# Altium project AMC_FMC_Carrier.PrjPcb (part 9 of 9)
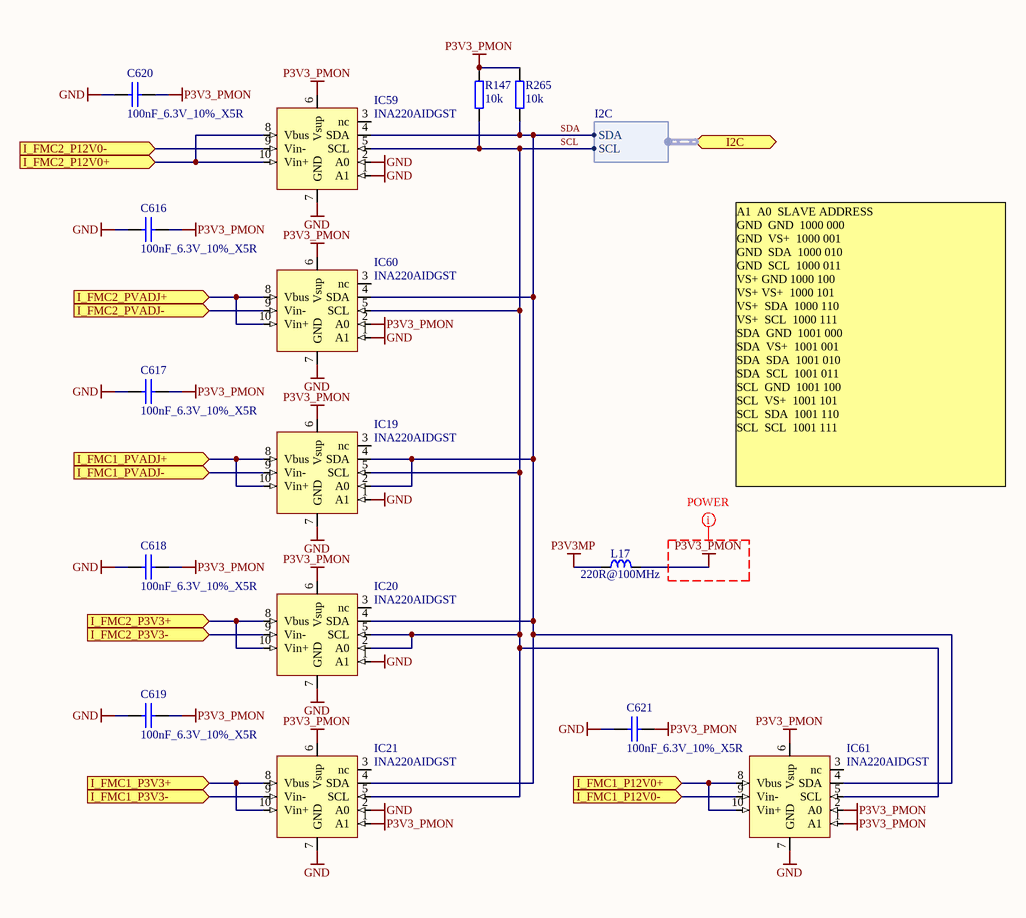
[diagram p28: UI_mon.SchDoc]

## Nets that join several sheets
FMC1_P3V3: HPC1 (10 pins), SUP_3.3_FMC (6 pins)
FMC2_P3V3: HPC2 (10 pins), SUP_3.3_FMC (6 pins)
GND: AMC_FMC_Carrier (43 pins), HPC1 (182 pins), HPC2 (181 pins), FPGA (17 pins), FPGA_SDRAM (C134.2 C138.2 C140.2 C141.2), FMC_HPC1 (16 pins), FMC_HPC2 (7 pins), FPGA_SUP (500 pins), SDRAM (150 pins), IPMI (5 pins), CPU (55 pins), USB_UART (9 pins), JTAG_Configuration (21 pins), M-LVDS PHY (65 pins), Clock_management (44 pins), Clock_WR (46 pins), FMC_Clocks (22 pins), AMC-SATA (6 pins), HeightRuleRoom1.9mm (Cxxx.1 Cxxx.2), SUP_1.2_1.8 (25 pins), SUP_3.3_FMC (34 pins), SUP_1V (37 pins), SUP_2.5_FMC (38 pins), UI_mon (18 pins)
MGTAVTT_G10: FPGA_MGT (R239.1), FPGA_SUP (21 pins)
MGTAVTT_G11: FPGA_MGT (R142.1), FPGA_SUP (21 pins)
P1V0: FPGA_SUP (123 pins), SUP_1V (23 pins)
P1V2: FPGA_SUP (FB7.1 FB8.1), SUP_1.2_1.8 (9 pins)
P1V5: FPGA_SUP (30 pins), SDRAM (108 pins), M-LVDS PHY (20 pins)
P1V8: FPGA_SUP (L12.1), SUP_1.2_1.8 (9 pins)
P3V3: FPGA (24 pins), FMC_HPC1 (LD1.4), FPGA_SUP (5 pins), JTAG_Configuration (10 pins), M-LVDS PHY (48 pins), Clock_management (7 pins), Clock_WR (L13.1 R220.2 R223.2 R272.2), FMC_Clocks (FB_FIN1.1 FB_FIN2.1)
P3V3MP: FMC_HPC1 (C102.1 IC56.7 R179.2), CPU (62 pins), SUP_1.2_1.8 (R77.1), SUP_1V (R110.2), SUP_2.5_FMC (C475.2 C476.1 IC11.6 IC11.11), UI_mon (L17.1)
P12V: SUP_1.2_1.8 (6 pins), SUP_3.3_FMC (11 pins), SUP_1V (15 pins), SUP_2.5_FMC (11 pins)
PVADJ1: HPC1 (8 pins), FMC_HPC1 (C100.1 IC56.2 R83.2 R178.2), FPGA_SUP (70 pins), SUP_2.5_FMC (5 pins)
PVADJ2: HPC2 (8 pins), FMC_HPC2 (R270.1), FPGA_SUP (69 pins), Clock_management (7 pins), SUP_2.5_FMC (5 pins)
VREF: FPGA_SDRAM (8 pins), SDRAM (16 pins)
VTT: FPGA_SDRAM (R143.1 R181.1), SDRAM (40 pins)
3P3VAUX_R: AMC_FMC_Carrier (R124.2), HPC2 (J1B.c34)
CLK20_VCXO: Clock_management (C410.1), Clock_WR (R217.2 R221.1)
CLKS1.CLK0_M2C_N: HPC1 (J1A.h5), FMC_HPC1 (IC2.H6), Clock_management (C485.1)
CLKS1.CLK0_M2C_P: HPC1 (J1A.h4), FMC_HPC1 (IC2.H7), Clock_management (C483.1)
CLKS1.CLK1_M2C_N: HPC1 (J1A.g3), FMC_HPC1 (IC2.N4), Clock_management (C489.1)
CLKS1.CLK1_M2C_P: HPC1 (J1A.g2), FMC_HPC1 (IC2.P5), Clock_management (C487.1)
CLKS1.CLK2_BIDIR_N: HPC1 (J1A.k5), FMC_HPC1 (IC2.G4), Clock_management (C493.1), FMC_Clocks (IC46.5)
CLKS1.CLK2_BIDIR_P: HPC1 (J1A.k4), FMC_HPC1 (IC2.G5), Clock_management (C491.1), FMC_Clocks (IC46.6)
CLKS1.CLK3_BIDIR_N: HPC1 (J1A.j3), FMC_HPC1 (IC2.R6), Clock_management (C497.1), FMC_Clocks (IC48.5)
CLKS1.CLK3_BIDIR_P: HPC1 (J1A.j2), FMC_HPC1 (IC2.R5), Clock_management (C495.1), FMC_Clocks (IC48.6)
CLKS1.CLK_DIR: HPC1 (J1A.b1), FMC_Clocks (IC46.3 IC48.3 R209.2)
CLKS2.CLK0_M2C_N: HPC2 (J1B.h5), FMC_HPC2 (IC2.AB30), Clock_management (C501.1)
CLKS2.CLK0_M2C_P: HPC2 (J1B.h4), FMC_HPC2 (IC2.AA30), Clock_management (C499.1)
CLKS2.CLK1_M2C_N: HPC2 (J1B.g3), FMC_HPC2 (IC2.AG29), Clock_management (C505.1)
CLKS2.CLK1_M2C_P: HPC2 (J1B.g2), FMC_HPC2 (IC2.AG30), Clock_management (C503.1)
CLKS2.CLK2_BIDIR_N: HPC2 (J1B.k5), FMC_HPC2 (IC2.AH29), Clock_management (C509.1), FMC_Clocks (IC47.5)
CLKS2.CLK2_BIDIR_P: HPC2 (J1B.k4), FMC_HPC2 (IC2.AH28), Clock_management (C507.1), FMC_Clocks (IC47.6)
CLKS2.CLK3_BIDIR_N: HPC2 (J1B.j3), FMC_HPC2 (IC2.Y30), Clock_management (C513.1), FMC_Clocks (IC49.5)
CLKS2.CLK3_BIDIR_P: HPC2 (J1B.j2), FMC_HPC2 (IC2.Y31), Clock_management (C511.1), FMC_Clocks (IC49.6)
CLKS2.CLK_DIR: HPC2 (J1B.b1), FMC_Clocks (IC47.3 IC49.3 R210.2)
CONSOLE_RXD: CPU (IC1.85 U1.27), USB_UART (R275.1)
CONSOLE_TXD: CPU (IC1.82 U1.28), USB_UART (R276.1)
CPU.SCL: FMC_HPC1 (IC56.6), CPU (IC1.47 R176.2 U1.26), Clock_management (R137.2)
CPU.SDA: FMC_HPC1 (IC56.5), CPU (IC1.46 R174.2 U1.25), Clock_management (R136.2)
DP1.DP0_C2M_N: HPC1 (J1A.c3), FPGA_MGT (C179.1)
DP1.DP0_C2M_P: HPC1 (J1A.c2), FPGA_MGT (C178.1)
DP1.DP0_M2C_N: HPC1 (J1A.c7), FPGA_MGT (C181.1)
DP1.DP0_M2C_P: HPC1 (J1A.c6), FPGA_MGT (C180.1)
DP1.DP1_C2M_N: HPC1 (J1A.a23), FPGA_MGT (C185.1)
DP1.DP1_C2M_P: HPC1 (J1A.a22), FPGA_MGT (C184.1)
DP1.DP1_M2C_N: HPC1 (J1A.a3), FPGA_MGT (C187.1)
DP1.DP1_M2C_P: HPC1 (J1A.a2), FPGA_MGT (C186.1)
DP1.DP2_C2M_N: HPC1 (J1A.a27), FPGA_MGT (C191.1)
DP1.DP2_C2M_P: HPC1 (J1A.a26), FPGA_MGT (C190.1)
DP1.DP2_M2C_N: HPC1 (J1A.a7), FPGA_MGT (C193.1)
DP1.DP2_M2C_P: HPC1 (J1A.a6), FPGA_MGT (C192.1)
DP1.DP3_C2M_N: HPC1 (J1A.a31), FPGA_MGT (C195.1)
DP1.DP3_C2M_P: HPC1 (J1A.a30), FPGA_MGT (C194.1)
DP1.DP3_M2C_N: HPC1 (J1A.a11), FPGA_MGT (C197.1)
DP1.DP3_M2C_P: HPC1 (J1A.a10), FPGA_MGT (C196.1)
DP2.DP0_C2M_N: HPC2 (J1B.c3), FPGA_MGT (C199.1)
DP2.DP0_C2M_P: HPC2 (J1B.c2), FPGA_MGT (C198.1)
DP2.DP0_M2C_N: HPC2 (J1B.c7), FPGA_MGT (C201.1)
DP2.DP0_M2C_P: HPC2 (J1B.c6), FPGA_MGT (C200.1)
DP2.DP1_C2M_N: HPC2 (J1B.a23), FPGA_MGT (C205.1)
DP2.DP1_C2M_P: HPC2 (J1B.a22), FPGA_MGT (C204.1)
DP2.DP1_M2C_N: HPC2 (J1B.a3), FPGA_MGT (C207.1)
DP2.DP1_M2C_P: HPC2 (J1B.a2), FPGA_MGT (C206.1)
DP2.DP2_C2M_N: HPC2 (J1B.a27), FPGA_MGT (C629.1)
DP2.DP2_C2M_P: HPC2 (J1B.a26), FPGA_MGT (C627.1)
DP2.DP2_M2C_N: HPC2 (J1B.a7), FPGA_MGT (C633.1)
DP2.DP2_M2C_P: HPC2 (J1B.a6), FPGA_MGT (C631.1)
DP2.DP3_C2M_N: HPC2 (J1B.a31), FPGA_MGT (C628.1)
DP2.DP3_C2M_P: HPC2 (J1B.a30), FPGA_MGT (C626.1)
DP2.DP3_M2C_N: HPC2 (J1B.a11), FPGA_MGT (C632.1)
DP2.DP3_M2C_P: HPC2 (J1B.a10), FPGA_MGT (C630.1)
FDDR.A0: FPGA_SDRAM (IC2.AP4), SDRAM (5 pins)
FDDR.A1: FPGA_SDRAM (IC2.AJ6), SDRAM (5 pins)
FDDR.A2: FPGA_SDRAM (IC2.AM4), SDRAM (5 pins)
FDDR.A3: FPGA_SDRAM (IC2.AM6), SDRAM (5 pins)
FDDR.A4: FPGA_SDRAM (IC2.AN4), SDRAM (5 pins)
FDDR.A5: FPGA_SDRAM (IC2.AK3), SDRAM (5 pins)
FDDR.A6: FPGA_SDRAM (IC2.AK5), SDRAM (5 pins)
FDDR.A7: FPGA_SDRAM (IC2.AP6), SDRAM (5 pins)
FDDR.A8: FPGA_SDRAM (IC2.AK6), SDRAM (5 pins)
FDDR.A9: FPGA_SDRAM (IC2.AL4), SDRAM (5 pins)
FDDR.A10: FPGA_SDRAM (IC2.AN2), SDRAM (5 pins)
FDDR.A11: FPGA_SDRAM (IC2.AJ8), SDRAM (5 pins)
FDDR.A12: FPGA_SDRAM (IC2.AP5), SDRAM (5 pins)
FDDR.A13: FPGA_SDRAM (IC2.AM7), SDRAM (5 pins)
FDDR.A14: FPGA_SDRAM (IC2.AK8), SDRAM (5 pins)
FDDR.A15: FPGA_SDRAM (IC2.AP3), SDRAM (5 pins)
FDDR.BA0: FPGA_SDRAM (IC2.AM2), SDRAM (5 pins)
FDDR.BA1: FPGA_SDRAM (IC2.AK2), SDRAM (5 pins)
FDDR.BA2: FPGA_SDRAM (IC2.AK1), SDRAM (5 pins)
FDDR.CAS_N: FPGA_SDRAM (IC2.AL2), SDRAM (5 pins)
FDDR.CE0_N: FPGA_SDRAM (IC2.AN3), SDRAM (5 pins)
FDDR.CKE0: FPGA_SDRAM (IC2.AJ5), SDRAM (5 pins)
FDDR.CLK0_N: FPGA_SDRAM (IC2.AM5), SDRAM (5 pins)
FDDR.CLK0_P: FPGA_SDRAM (IC2.AL5), SDRAM (5 pins)
FDDR.D0: FPGA_SDRAM (IC2.AD11), SDRAM (IC24.B3)
FDDR.D1: FPGA_SDRAM (IC2.AE10), SDRAM (IC24.C7)
FDDR.D2: FPGA_SDRAM (IC2.AF12), SDRAM (IC24.C2)
FDDR.D3: FPGA_SDRAM (IC2.AG11), SDRAM (IC24.C8)
FDDR.D4: FPGA_SDRAM (IC2.AE11), SDRAM (IC24.E3)
FDDR.D5: FPGA_SDRAM (IC2.AH11), SDRAM (IC24.E8)
FDDR.D6: FPGA_SDRAM (IC2.AG12), SDRAM (IC24.D2)
FDDR.D7: FPGA_SDRAM (IC2.AH9), SDRAM (IC24.E7)
FDDR.D8: FPGA_SDRAM (IC2.AD6), SDRAM (IC16.B3)
FDDR.D9: FPGA_SDRAM (IC2.AG7), SDRAM (IC16.C7)
FDDR.D10: FPGA_SDRAM (IC2.AF9), SDRAM (IC16.C2)
FDDR.D11: FPGA_SDRAM (IC2.AH7), SDRAM (IC16.C8)
FDDR.D12: FPGA_SDRAM (IC2.AE8), SDRAM (IC16.E3)
FDDR.D13: FPGA_SDRAM (IC2.AF8), SDRAM (IC16.E8)
FDDR.D14: FPGA_SDRAM (IC2.AE7), SDRAM (IC16.D2)
FDDR.D15: FPGA_SDRAM (IC2.AF7), SDRAM (IC16.E7)
FDDR.D16: FPGA_SDRAM (IC2.AF4), SDRAM (IC26.B3)
FDDR.D17: FPGA_SDRAM (IC2.AF5), SDRAM (IC26.C7)
FDDR.D18: FPGA_SDRAM (IC2.AD3), SDRAM (IC26.C2)
FDDR.D19: FPGA_SDRAM (IC2.AG5), SDRAM (IC26.C8)
FDDR.D20: FPGA_SDRAM (IC2.AD5), SDRAM (IC26.E3)
FDDR.D21: FPGA_SDRAM (IC2.AG6), SDRAM (IC26.E8)
FDDR.D22: FPGA_SDRAM (IC2.AD4), SDRAM (IC26.D2)
FDDR.D23: FPGA_SDRAM (IC2.AE3), SDRAM (IC26.E7)
FDDR.D24: FPGA_SDRAM (IC2.AG1), SDRAM (IC15.B3)
FDDR.D25: FPGA_SDRAM (IC2.AG2), SDRAM (IC15.C7)
FDDR.D26: FPGA_SDRAM (IC2.AE1), SDRAM (IC15.C2)
FDDR.D27: FPGA_SDRAM (IC2.AF3), SDRAM (IC15.C8)
FDDR.D28: FPGA_SDRAM (IC2.AE2), SDRAM (IC15.E3)
FDDR.D29: FPGA_SDRAM (IC2.AH3), SDRAM (IC15.E8)
FDDR.D30: FPGA_SDRAM (IC2.AD1), SDRAM (IC15.D2)
FDDR.D31: FPGA_SDRAM (IC2.AF2), SDRAM (IC15.E7)
FDDR.DQM0: FPGA_SDRAM (IC2.AD10), SDRAM (IC24.B7)
FDDR.DQM1: FPGA_SDRAM (IC2.AH6), SDRAM (IC16.B7)
FDDR.DQM2: FPGA_SDRAM (IC2.AG4), SDRAM (IC26.B7)
FDDR.DQM3: FPGA_SDRAM (IC2.AH1), SDRAM (IC15.B7)
FDDR.DQS0_N: FPGA_SDRAM (IC2.AG9), SDRAM (IC24.D3)
FDDR.DQS0_P: FPGA_SDRAM (IC2.AG10), SDRAM (IC24.C3)
FDDR.DQS1_N: FPGA_SDRAM (IC2.AD8), SDRAM (IC16.D3)
FDDR.DQS1_P: FPGA_SDRAM (IC2.AD9), SDRAM (IC16.C3)
FDDR.DQS2_N: FPGA_SDRAM (IC2.AJ4), SDRAM (IC26.D3)
FDDR.DQS2_P: FPGA_SDRAM (IC2.AH4), SDRAM (IC26.C3)
FDDR.DQS3_N: FPGA_SDRAM (IC2.AJ1), SDRAM (IC15.D3)
FDDR.DQS3_P: FPGA_SDRAM (IC2.AH2), SDRAM (IC15.C3)
FDDR.ODT0: FPGA_SDRAM (IC2.AP1), SDRAM (5 pins)
FDDR.RAS_N: FPGA_SDRAM (IC2.AN1), SDRAM (5 pins)
FDDR.RST_N: FPGA_SDRAM (IC2.AJ9), SDRAM (5 pins)
FDDR.WE_N: FPGA_SDRAM (IC2.AM1), SDRAM (5 pins)
FIN1_CLK2_N: Clock_management (IC8.87), FMC_Clocks (IC46.1 R207.1 R241.1)
FIN1_CLK2_P: Clock_management (IC8.86), FMC_Clocks (IC46.8 R207.2 R240.1)
FIN1_CLK3_N: Clock_management (IC8.84), FMC_Clocks (IC48.1 R211.1)
FIN1_CLK3_P: Clock_management (IC8.83), FMC_Clocks (IC48.8 R211.2)
FIN2_CLK2_N: Clock_management (IC8.96), FMC_Clocks (IC47.1 R208.1 R243.1)
FIN2_CLK2_P: Clock_management (IC8.95), FMC_Clocks (IC47.8 R208.2 R242.1)
FIN2_CLK3_N: Clock_management (IC8.99), FMC_Clocks (IC49.1 R212.1)
FIN2_CLK3_P: Clock_management (IC8.98), FMC_Clocks (IC49.8 R212.2)
FJTAG.TCK: FPGA (IC2.AE12), JTAG_Configuration (IC6.46 R164.1)
FJTAG.TDI: FPGA (IC2.AE14), JTAG_Configuration (IC6.43)
FJTAG.TDO: FPGA (IC2.AD13), JTAG_Configuration (IC6.44)
FJTAG.TMS: FPGA (IC2.AE13), JTAG_Configuration (IC6.45 R225.1)
FLASH_CLK: FPGA (R293.1), FMC_HPC1 (IC2.J8)
FLASH_CSn: FPGA (R299.1), FMC_HPC1 (IC2.J9)
FSDC.SDRAM_CLK1_N: FPGA_SDRAM (IC2.AL7 R143.2), Clock_management (C396.2)
FSDC.SDRAM_CLK1_P: FPGA_SDRAM (IC2.AK7 R181.2), Clock_management (C394.2)
FSPI.DONE: FPGA (IC2.P11 Q9.1 R161.1), CPU (R56.2 R153.2)
FSPI.FCS_~{B}: FPGA (IC13.1 IC17.7 R127.1), FMC_HPC2 (IC2.Y27), CPU (R32.2 R154.1)
FSPI.FLASH_D2: FPGA (R126.1 R303.1), FMC_HPC2 (IC2.V26)
FSPI.FLASH_D3: FPGA (R133.1 R304.1), FMC_HPC2 (IC2.V27)
FSPI.FLASH_Q/D1: FPGA (R125.2 R298.2), FMC_HPC2 (IC2.V29), CPU (R28.2 R156.1)
FSPI.FLASH_SI/D0: FPGA (IC13.5 IC17.15 R291.1), FMC_HPC2 (IC2.V28), CPU (R30.2 R157.1)
FSPI.FPGA_CCLK: FPGA (6 pins), CPU (R27.2 R155.1)
FSPI.MISO1: FPGA (R296.2), CPU (R33.1 R150.2)
FSPI.MOSI1: FPGA (R292.1), CPU (R31.1 R151.2)
FSPI.PROGRAM_B: FPGA (IC2.N11 R160.1), CPU (R34.2 R152.2)
FSPI.SCK1: FPGA (R295.1), CPU (R35.1 R148.2)
FSPI.SSEL1: FPGA (R300.1), CPU (R29.1 R149.2)
GBT1.GBTCLK0_M2C_N: HPC1 (J1A.d5), FPGA_MGT (C183.1)
GBT1.GBTCLK0_M2C_P: HPC1 (J1A.d4), FPGA_MGT (C182.1)
GBT1.GBTCLK1_M2C_N: HPC1 (J1A.b21), FPGA_MGT (C189.1)
GBT1.GBTCLK1_M2C_P: HPC1 (J1A.b20), FPGA_MGT (C188.1)
GBT2.GBTCLK0_M2C_N: HPC2 (J1B.d5), FPGA_MGT (C203.1)
GBT2.GBTCLK0_M2C_P: HPC2 (J1B.d4), FPGA_MGT (C202.1)
GBT2.GBTCLK1_M2C_N: HPC2 (J1B.b21), FPGA_MGT (C635.1)
GBT2.GBTCLK1_M2C_P: HPC2 (J1B.b20), FPGA_MGT (C634.1)
HA1.HA00_CC_N: HPC1 (J1A.f5), FMC_HPC1 (IC2.H29)
HA1.HA00_CC_P: HPC1 (J1A.f4), FMC_HPC1 (IC2.J29)
HA1.HA01_CC_N: HPC1 (J1A.e3), FMC_HPC1 (IC2.K28)
HA1.HA01_CC_P: HPC1 (J1A.e2), FMC_HPC1 (IC2.L28)
HA1.HA02_N: HPC1 (J1A.k8), FMC_HPC1 (IC2.K33)
HA1.HA02_P: HPC1 (J1A.k7), FMC_HPC1 (IC2.J34)
HA1.HA03_N: HPC1 (J1A.j7), FMC_HPC1 (IC2.J30)
HA1.HA03_P: HPC1 (J1A.j6), FMC_HPC1 (IC2.K30)
HA1.HA04_N: HPC1 (J1A.f8), FMC_HPC1 (IC2.L33)
HA1.HA04_P: HPC1 (J1A.f7), FMC_HPC1 (IC2.L34)
HA1.HA05_N: HPC1 (J1A.e7), FMC_HPC1 (IC2.J33)
HA1.HA05_P: HPC1 (J1A.e6), FMC_HPC1 (IC2.H34)
HA1.HA06_N: HPC1 (J1A.k11), FMC_HPC1 (IC2.L27)
HA1.HA06_P: HPC1 (J1A.k10), FMC_HPC1 (IC2.K27)
HA1.HA07_N: HPC1 (J1A.j10), FMC_HPC1 (IC2.L32)
HA1.HA07_P: HPC1 (J1A.j9), FMC_HPC1 (IC2.K32)
HA1.HA08_N: HPC1 (J1A.f11), FMC_HPC1 (IC2.L29)
HA1.HA08_P: HPC1 (J1A.f10), FMC_HPC1 (IC2.L30)
HA1.HA09_N: HPC1 (J1A.e10), FMC_HPC1 (IC2.K31)
HA1.HA09_P: HPC1 (J1A.e9), FMC_HPC1 (IC2.J31)
HA1.HA10_N: HPC1 (J1A.k14), FMC_HPC1 (IC2.H32)
HA1.HA10_P: HPC1 (J1A.k13), FMC_HPC1 (IC2.G32)
HA1.HA11_N: HPC1 (J1A.j13), FMC_HPC1 (IC2.M25)
HA1.HA11_P: HPC1 (J1A.j12), FMC_HPC1 (IC2.L25)
HA1.HA12_N: HPC1 (J1A.f14), FMC_HPC1 (IC2.H33)
HA1.HA12_P: HPC1 (J1A.f13), FMC_HPC1 (IC2.G34)
HA1.HA13_N: HPC1 (J1A.e13), FMC_HPC1 (IC2.J25)
HA1.HA13_P: HPC1 (J1A.e12), FMC_HPC1 (IC2.K25)
HA1.HA14_N: HPC1 (J1A.j16), FMC_HPC1 (IC2.M24)
HA1.HA14_P: HPC1 (J1A.j15), FMC_HPC1 (IC2.L24)
HA1.HA15_N: HPC1 (J1A.f17), FMC_HPC1 (IC2.G29)
HA1.HA15_P: HPC1 (J1A.f16), FMC_HPC1 (IC2.G30)
HA1.HA16_N: HPC1 (J1A.e16), FMC_HPC1 (IC2.H31)
HA1.HA16_P: HPC1 (J1A.e15), FMC_HPC1 (IC2.G31)
HA1.HA17_CC_N: HPC1 (J1A.k17), FMC_HPC1 (IC2.H28)
HA1.HA17_CC_P: HPC1 (J1A.k16), FMC_HPC1 (IC2.J28)
HA1.HA18_N: HPC1 (J1A.j19), FMC_HPC1 (IC2.H27)
HA1.HA18_P: HPC1 (J1A.j18), FMC_HPC1 (IC2.G27)
HA1.HA19_N: HPC1 (J1A.f20), FMC_HPC1 (IC2.H26)
HA1.HA19_P: HPC1 (J1A.f19), FMC_HPC1 (IC2.G26)
HA1.HA20_N: HPC1 (J1A.e19), FMC_HPC1 (IC2.J26)
HA1.HA20_P: HPC1 (J1A.e18), FMC_HPC1 (IC2.K26)
HA1.HA21_N: HPC1 (J1A.k20), FMC_HPC1 (IC2.G24)
HA1.HA21_P: HPC1 (J1A.k19), FMC_HPC1 (IC2.G25)
HA1.HA22_N: HPC1 (J1A.j22), FMC_HPC1 (IC2.J24)
HA1.HA22_P: HPC1 (J1A.j21), FMC_HPC1 (IC2.H24)
HA1.HA23_N: HPC1 (J1A.k23), FMC_HPC1 (IC2.K23)
HA1.HA23_P: HPC1 (J1A.k22), FMC_HPC1 (IC2.J23)
HA2.HA00_CC_N: HPC2 (J1B.f5), FMC_HPC2 (IC2.AL30)
HA2.HA00_CC_P: HPC2 (J1B.f4), FMC_HPC2 (IC2.AM30)
HA2.HA01_CC_N: HPC2 (J1B.e3), FMC_HPC2 (IC2.AL29)
HA2.HA01_CC_P: HPC2 (J1B.e2), FMC_HPC2 (IC2.AL28)
HA2.HA02_N: HPC2 (J1B.k8), FMC_HPC2 (IC2.AN31)
HA2.HA02_P: HPC2 (J1B.k7), FMC_HPC2 (IC2.AP31)
HA2.HA03_N: HPC2 (J1B.j7), FMC_HPC2 (IC2.AN26)
HA2.HA03_P: HPC2 (J1B.j6), FMC_HPC2 (IC2.AM26)
HA2.HA04_N: HPC2 (J1B.f8), FMC_HPC2 (IC2.AJ25)
HA2.HA04_P: HPC2 (J1B.f7), FMC_HPC2 (IC2.AK25)
HA2.HA05_N: HPC2 (J1B.e7), FMC_HPC2 (IC2.AM25)
HA2.HA05_P: HPC2 (J1B.e6), FMC_HPC2 (IC2.AL25)
HA2.HA06_N: HPC2 (J1B.k11), FMC_HPC2 (IC2.AL32)
HA2.HA06_P: HPC2 (J1B.k10), FMC_HPC2 (IC2.AM32)
HA2.HA07_N: HPC2 (J1B.j10), FMC_HPC2 (IC2.AM31)
HA2.HA07_P: HPC2 (J1B.j9), FMC_HPC2 (IC2.AN32)
HA2.HA08_N: HPC2 (J1B.f11), FMC_HPC2 (IC2.AM27)
HA2.HA08_P: HPC2 (J1B.f10), FMC_HPC2 (IC2.AN27)
HA2.HA09_N: HPC2 (J1B.e10), FMC_HPC2 (IC2.AJ26)
HA2.HA09_P: HPC2 (J1B.e9), FMC_HPC2 (IC2.AK26)
HA2.HA10_N: HPC2 (J1B.k14), FMC_HPC2 (IC2.AP26)
HA2.HA10_P: HPC2 (J1B.k13), FMC_HPC2 (IC2.AP25)
HA2.HA11_N: HPC2 (J1B.j13), FMC_HPC2 (IC2.AK33)
HA2.HA11_P: HPC2 (J1B.j12), FMC_HPC2 (IC2.AL33)
HA2.HA12_N: HPC2 (J1B.f14), FMC_HPC2 (IC2.AM29)
HA2.HA12_P: HPC2 (J1B.f13), FMC_HPC2 (IC2.AN29)
HA2.HA13_N: HPC2 (J1B.e13), FMC_HPC2 (IC2.AN28)
HA2.HA13_P: HPC2 (J1B.e12), FMC_HPC2 (IC2.AP28)
HA2.HA14_N: HPC2 (J1B.j16), FMC_HPC2 (IC2.AN34)
HA2.HA14_P: HPC2 (J1B.j15), FMC_HPC2 (IC2.AP34)
HA2.HA15_N: HPC2 (J1B.f17), FMC_HPC2 (IC2.AK30)
HA2.HA15_P: HPC2 (J1B.f16), FMC_HPC2 (IC2.AJ29)
HA2.HA16_N: HPC2 (J1B.e16), FMC_HPC2 (IC2.AK27)
HA2.HA16_P: HPC2 (J1B.e15), FMC_HPC2 (IC2.AL27)
HA2.HA17_CC_N: HPC2 (J1B.k17), FMC_HPC2 (IC2.AJ28)
HA2.HA17_CC_P: HPC2 (J1B.k16), FMC_HPC2 (IC2.AK28)
HA2.HA18_N: HPC2 (J1B.j19), FMC_HPC2 (IC2.AN33)
HA2.HA18_P: HPC2 (J1B.j18), FMC_HPC2 (IC2.AP33)
HA2.HA19_N: HPC2 (J1B.f20), FMC_HPC2 (IC2.AJ30)
HA2.HA19_P: HPC2 (J1B.f19), FMC_HPC2 (IC2.AK31)
HA2.HA20_N: HPC2 (J1B.e19), FMC_HPC2 (IC2.AJ31)
HA2.HA20_P: HPC2 (J1B.e18), FMC_HPC2 (IC2.AK32)
HA2.HA21_N: HPC2 (J1B.k20), FMC_HPC2 (IC2.AP30)
HA2.HA21_P: HPC2 (J1B.k19), FMC_HPC2 (IC2.AP29)
HA2.HA22_N: HPC2 (J1B.j22), FMC_HPC2 (IC2.AL34)
HA2.HA22_P: HPC2 (J1B.j21), FMC_HPC2 (IC2.AM34)
HA2.HA23_N: HPC2 (J1B.k23), FMC_HPC2 (IC2.AJ33)
HA2.HA23_P: HPC2 (J1B.k22), FMC_HPC2 (IC2.AJ34)
HB1.HB00_CC_N: HPC1 (J1A.k26), FMC_HPC1 (IC2.W5)
HB1.HB00_CC_P: HPC1 (J1A.k25), FMC_HPC1 (IC2.Y5)
HB1.HB01_N: HPC1 (J1A.j25), FMC_HPC1 (IC2.W8)
HB1.HB01_P: HPC1 (J1A.j24), FMC_HPC1 (IC2.W9)
HB1.HB02_N: HPC1 (J1A.f23), FMC_HPC1 (IC2.V8)
HB1.HB02_P: HPC1 (J1A.f22), FMC_HPC1 (IC2.V9)
HB1.HB03_N: HPC1 (J1A.e22), FMC_HPC1 (IC2.Y10)
HB1.HB03_P: HPC1 (J1A.e21), FMC_HPC1 (IC2.W10)
HB1.HB04_N: HPC1 (J1A.f26), FMC_HPC1 (IC2.Y7)
HB1.HB04_P: HPC1 (J1A.f25), FMC_HPC1 (IC2.Y8)
HB1.HB05_N: HPC1 (J1A.e25), FMC_HPC1 (IC2.AA9)
HB1.HB05_P: HPC1 (J1A.e24), FMC_HPC1 (IC2.AA10)
HB1.HB06_CC_N: HPC1 (J1A.k29), FMC_HPC1 (IC2.W4)
HB1.HB06_CC_P: HPC1 (J1A.k28), FMC_HPC1 (IC2.V4)
HB1.HB07_N: HPC1 (J1A.j28), FMC_HPC1 (IC2.AB9)
HB1.HB07_P: HPC1 (J1A.j27), FMC_HPC1 (IC2.AB10)
HB1.HB08_N: HPC1 (J1A.f29), FMC_HPC1 (IC2.W3)
HB1.HB08_P: HPC1 (J1A.f28), FMC_HPC1 (IC2.V3)
HB1.HB09_N: HPC1 (J1A.e28), FMC_HPC1 (IC2.V1)
HB1.HB09_P: HPC1 (J1A.e27), FMC_HPC1 (IC2.V2)
HB1.HB10_N: HPC1 (J1A.k32), FMC_HPC1 (IC2.V6)
HB1.HB10_P: HPC1 (J1A.k31), FMC_HPC1 (IC2.V7)
HB1.HB11_N: HPC1 (J1A.j31), FMC_HPC1 (IC2.Y1)
HB1.HB11_P: HPC1 (J1A.j30), FMC_HPC1 (IC2.W1)
HB1.HB12_N: HPC1 (J1A.f32), FMC_HPC1 (IC2.AC6)
HB1.HB12_P: HPC1 (J1A.f31), FMC_HPC1 (IC2.AC7)
HB1.HB13_N: HPC1 (J1A.e31), FMC_HPC1 (IC2.Y2)
HB1.HB13_P: HPC1 (J1A.e30), FMC_HPC1 (IC2.Y3)
HB1.HB14_N: HPC1 (J1A.k35), FMC_HPC1 (IC2.AC1)
HB1.HB14_P: HPC1 (J1A.k34), FMC_HPC1 (IC2.AC2)
HB1.HB15_N: HPC1 (J1A.j34), FMC_HPC1 (IC2.AC8)
HB1.HB15_P: HPC1 (J1A.j33), FMC_HPC1 (IC2.AC9)
HB1.HB16_N: HPC1 (J1A.f35), FMC_HPC1 (IC2.AB1)
HB1.HB16_P: HPC1 (J1A.f34), FMC_HPC1 (IC2.AB2)
HB1.HB17_CC_N: HPC1 (J1A.k38), FMC_HPC1 (IC2.AA4)
HB1.HB17_CC_P: HPC1 (J1A.k37), FMC_HPC1 (IC2.AA5)
HB1.HB18_N: HPC1 (J1A.j37), FMC_HPC1 (IC2.AB6)
HB1.HB18_P: HPC1 (J1A.j36), FMC_HPC1 (IC2.AB7)
HB1.HB19_N: HPC1 (J1A.e34), FMC_HPC1 (IC2.AB4)
HB1.HB19_P: HPC1 (J1A.e33), FMC_HPC1 (IC2.AB5)
HB1.HB20_N: HPC1 (J1A.f38), FMC_HPC1 (IC2.AA2)
HB1.HB20_P: HPC1 (J1A.f37), FMC_HPC1 (IC2.AA3)
HB1.HB21_N: HPC1 (J1A.e37), FMC_HPC1 (IC2.AC4)
HB1.HB21_P: HPC1 (J1A.e36), FMC_HPC1 (IC2.AC3)
HB2.HB00_CC_N: HPC2 (J1B.k26), FMC_HPC2 (IC2.T29)
HB2.HB00_CC_P: HPC2 (J1B.k25), FMC_HPC2 (IC2.U29)
HB2.HB01_N: HPC2 (J1B.j25), FMC_HPC2 (IC2.N26)
HB2.HB01_P: HPC2 (J1B.j24), FMC_HPC2 (IC2.M27)
HB2.HB02_N: HPC2 (J1B.f23), FMC_HPC2 (IC2.N34)
HB2.HB02_P: HPC2 (J1B.f22), FMC_HPC2 (IC2.M34)
HB2.HB03_N: HPC2 (J1B.e22), FMC_HPC2 (IC2.T34)
HB2.HB03_P: HPC2 (J1B.e21), FMC_HPC2 (IC2.U34)
HB2.HB04_N: HPC2 (J1B.f26), FMC_HPC2 (IC2.U27)
HB2.HB04_P: HPC2 (J1B.f25), FMC_HPC2 (IC2.U26)
HB2.HB05_N: HPC2 (J1B.e25), FMC_HPC2 (IC2.P34)
HB2.HB05_P: HPC2 (J1B.e24), FMC_HPC2 (IC2.P33)
HB2.HB06_CC_N: HPC2 (J1B.k29), FMC_HPC2 (IC2.P30)
HB2.HB06_CC_P: HPC2 (J1B.k28), FMC_HPC2 (IC2.R30)
HB2.HB07_N: HPC2 (J1B.j28), FMC_HPC2 (IC2.P24)
HB2.HB07_P: HPC2 (J1B.j27), FMC_HPC2 (IC2.N24)
HB2.HB08_N: HPC2 (J1B.f29), FMC_HPC2 (IC2.P26)
HB2.HB08_P: HPC2 (J1B.f28), FMC_HPC2 (IC2.R26)
HB2.HB09_N: HPC2 (J1B.e28), FMC_HPC2 (IC2.R28)
HB2.HB09_P: HPC2 (J1B.e27), FMC_HPC2 (IC2.T28)
HB2.HB10_N: HPC2 (J1B.k32), FMC_HPC2 (IC2.U25)
HB2.HB10_P: HPC2 (J1B.k31), FMC_HPC2 (IC2.T25)
HB2.HB11_N: HPC2 (J1B.j31), FMC_HPC2 (IC2.T27)
HB2.HB11_P: HPC2 (J1B.j30), FMC_HPC2 (IC2.R27)
HB2.HB12_N: HPC2 (J1B.f32), FMC_HPC2 (IC2.M32)
HB2.HB12_P: HPC2 (J1B.f31), FMC_HPC2 (IC2.N31)
HB2.HB13_N: HPC2 (J1B.e31), FMC_HPC2 (IC2.N28)
HB2.HB13_P: HPC2 (J1B.e30), FMC_HPC2 (IC2.N27)
HB2.HB14_N: HPC2 (J1B.k35), FMC_HPC2 (IC2.P31)
HB2.HB14_P: HPC2 (J1B.k34), FMC_HPC2 (IC2.R31)
HB2.HB15_N: HPC2 (J1B.j34), FMC_HPC2 (IC2.T30)
HB2.HB15_P: HPC2 (J1B.j33), FMC_HPC2 (IC2.U30)
HB2.HB16_N: HPC2 (J1B.f35), FMC_HPC2 (IC2.U31)
HB2.HB16_P: HPC2 (J1B.f34), FMC_HPC2 (IC2.U32)
HB2.HB17_CC_N: HPC2 (J1B.k38), FMC_HPC2 (IC2.P28)
HB2.HB17_CC_P: HPC2 (J1B.k37), FMC_HPC2 (IC2.P29)
HB2.HB18_N: HPC2 (J1B.j37), FMC_HPC2 (IC2.M29)
HB2.HB18_P: HPC2 (J1B.j36), FMC_HPC2 (IC2.N29)
HB2.HB19_N: HPC2 (J1B.e34), FMC_HPC2 (IC2.M30)
HB2.HB19_P: HPC2 (J1B.e33), FMC_HPC2 (IC2.M31)
HB2.HB20_N: HPC2 (J1B.f38), FMC_HPC2 (IC2.N33)
HB2.HB20_P: HPC2 (J1B.f37), FMC_HPC2 (IC2.N32)
HB2.HB21_N: HPC2 (J1B.e37), FMC_HPC2 (IC2.R33)
HB2.HB21_P: HPC2 (J1B.e36), FMC_HPC2 (IC2.T33)
I2C1.SCL: HPC1 (J1A.c30), CPU (IC1.58 R170.2 U1.36)
I2C1.SDA: HPC1 (J1A.c31), CPU (IC1.59 R171.2 U1.35)
I2C2.SCL: HPC2 (J1B.c30), CPU (IC1.49 R172.2 U1.46)
I2C2.SDA: HPC2 (J1B.c31), CPU (IC1.48 R173.2 U1.45)
JTAG1.TCK: HPC1 (J1A.d29), JTAG_Configuration (IC6.37)
JTAG1.TDI: HPC1 (J1A.d30), JTAG_Configuration (IC6.32)
JTAG1.TDO: HPC1 (J1A.d31), JTAG_Configuration (IC6.33)
JTAG1.TMS: HPC1 (J1A.d33), JTAG_Configuration (IC6.34)
JTAG1.TRST_L: HPC1 (J1A.d34), JTAG_Configuration (IC6.38)
JTAG2.TCK: HPC2 (J1B.d29), JTAG_Configuration (IC6.26)
JTAG2.TDI: HPC2 (J1B.d30), JTAG_Configuration (IC6.20)
JTAG2.TDO: HPC2 (J1B.d31), JTAG_Configuration (IC6.19)
JTAG2.TMS: HPC2 (J1B.d33), JTAG_Configuration (IC6.23)
JTAG2.TRST_L: HPC2 (J1B.d34), JTAG_Configuration (IC6.27)
LA1.LA00_CC_N: HPC1 (J1A.g7), FMC_HPC1 (IC2.K6)
LA1.LA00_CC_P: HPC1 (J1A.g6), FMC_HPC1 (IC2.K7)
LA1.LA01_CC_N: HPC1 (J1A.d9), FMC_HPC1 (IC2.J5)
LA1.LA01_CC_P: HPC1 (J1A.d8), FMC_HPC1 (IC2.J6)
LA1.LA02_N: HPC1 (J1A.h8), FMC_HPC1 (IC2.G6)
LA1.LA02_P: HPC1 (J1A.h7), FMC_HPC1 (IC2.G7)
LA1.LA03_N: HPC1 (J1A.g10), FMC_HPC1 (IC2.H1)
LA1.LA03_P: HPC1 (J1A.g9), FMC_HPC1 (IC2.G1)
LA1.LA04_N: HPC1 (J1A.h11), FMC_HPC1 (IC2.K1)
LA1.LA04_P: HPC1 (J1A.h10), FMC_HPC1 (IC2.J1)
LA1.LA05_N: HPC1 (J1A.d12), FMC_HPC1 (IC2.H3)
LA1.LA05_P: HPC1 (J1A.d11), FMC_HPC1 (IC2.H4)
LA1.LA06_N: HPC1 (J1A.c11), FMC_HPC1 (IC2.L5)
LA1.LA06_P: HPC1 (J1A.c10), FMC_HPC1 (IC2.K5)
LA1.LA07_N: HPC1 (J1A.h14), FMC_HPC1 (IC2.K2)
LA1.LA07_P: HPC1 (J1A.h13), FMC_HPC1 (IC2.K3)
LA1.LA08_N: HPC1 (J1A.g13), FMC_HPC1 (IC2.F2)
LA1.LA08_P: HPC1 (J1A.g12), FMC_HPC1 (IC2.F3)
LA1.LA09_N: HPC1 (J1A.d15), FMC_HPC1 (IC2.J3)
LA1.LA09_P: HPC1 (J1A.d14), FMC_HPC1 (IC2.J4)
LA1.LA10_N: HPC1 (J1A.c15), FMC_HPC1 (IC2.H2)
LA1.LA10_P: HPC1 (J1A.c14), FMC_HPC1 (IC2.G2)
LA1.LA11_N: HPC1 (J1A.h17), FMC_HPC1 (IC2.M2)
LA1.LA11_P: HPC1 (J1A.h16), FMC_HPC1 (IC2.L2)
LA1.LA12_N: HPC1 (J1A.g16), FMC_HPC1 (IC2.L8)
LA1.LA12_P: HPC1 (J1A.g15), FMC_HPC1 (IC2.K8)
LA1.LA13_N: HPC1 (J1A.d18), FMC_HPC1 (IC2.G9)
LA1.LA13_P: HPC1 (J1A.d17), FMC_HPC1 (IC2.G10)
LA1.LA14_N: HPC1 (J1A.c19), FMC_HPC1 (IC2.H8)
LA1.LA14_P: HPC1 (J1A.c18), FMC_HPC1 (IC2.H9)
LA1.LA15_N: HPC1 (J1A.h20), FMC_HPC1 (IC2.K11)
LA1.LA15_P: HPC1 (J1A.h19), FMC_HPC1 (IC2.J11)
LA1.LA16_N: HPC1 (J1A.g19), FMC_HPC1 (IC2.L9)
LA1.LA16_P: HPC1 (J1A.g18), FMC_HPC1 (IC2.L10)
LA1.LA17_CC_N: HPC1 (J1A.d21), FMC_HPC1 (IC2.T4)
LA1.LA17_CC_P: HPC1 (J1A.d20), FMC_HPC1 (IC2.T5)
LA1.LA18_CC_N: HPC1 (J1A.c23), FMC_HPC1 (IC2.P3)
LA1.LA18_CC_P: HPC1 (J1A.c22), FMC_HPC1 (IC2.P4)
LA1.LA19_N: HPC1 (J1A.h23), FMC_HPC1 (IC2.U4)
LA1.LA19_P: HPC1 (J1A.h22), FMC_HPC1 (IC2.U5)
LA1.LA20_N: HPC1 (J1A.g22), FMC_HPC1 (IC2.R10)
LA1.LA20_P: HPC1 (J1A.g21), FMC_HPC1 (IC2.P10)
LA1.LA21_N: HPC1 (J1A.h26), FMC_HPC1 (IC2.M7)
LA1.LA21_P: HPC1 (J1A.h25), FMC_HPC1 (IC2.M6)
LA1.LA22_N: HPC1 (J1A.g25), FMC_HPC1 (IC2.M4)
LA1.LA22_P: HPC1 (J1A.g24), FMC_HPC1 (IC2.M5)
LA1.LA23_N: HPC1 (J1A.d24), FMC_HPC1 (IC2.N3)
LA1.LA23_P: HPC1 (J1A.d23), FMC_HPC1 (IC2.N2)
LA1.LA24_N: HPC1 (J1A.h29), FMC_HPC1 (IC2.M11)
LA1.LA24_P: HPC1 (J1A.h28), FMC_HPC1 (IC2.M10)
LA1.LA25_N: HPC1 (J1A.g28), FMC_HPC1 (IC2.N8)
LA1.LA25_P: HPC1 (J1A.g27), FMC_HPC1 (IC2.N7)
LA1.LA26_N: HPC1 (J1A.d27), FMC_HPC1 (IC2.T2)
LA1.LA26_P: HPC1 (J1A.d26), FMC_HPC1 (IC2.T3)
LA1.LA27_N: HPC1 (J1A.c27), FMC_HPC1 (IC2.R2)
LA1.LA27_P: HPC1 (J1A.c26), FMC_HPC1 (IC2.R3)
LA1.LA28_N: HPC1 (J1A.h32), FMC_HPC1 (IC2.T7)
LA1.LA28_P: HPC1 (J1A.h31), FMC_HPC1 (IC2.T8)
LA1.LA29_N: HPC1 (J1A.g31), FMC_HPC1 (IC2.P9)
LA1.LA29_P: HPC1 (J1A.g30), FMC_HPC1 (IC2.P8)
LA1.LA30_N: HPC1 (J1A.h35), FMC_HPC1 (IC2.M1)
LA1.LA30_P: HPC1 (J1A.h34), FMC_HPC1 (IC2.N1)
LA1.LA31_N: HPC1 (J1A.g34), FMC_HPC1 (IC2.U7)
LA1.LA31_P: HPC1 (J1A.g33), FMC_HPC1 (IC2.U6)
LA1.LA32_N: HPC1 (J1A.h38), FMC_HPC1 (IC2.P1)
LA1.LA32_P: HPC1 (J1A.h37), FMC_HPC1 (IC2.R1)
LA1.LA33_N: HPC1 (J1A.g37), FMC_HPC1 (IC2.U2)
LA1.LA33_P: HPC1 (J1A.g36), FMC_HPC1 (IC2.U1)
LA2.LA00_CC_N: HPC2 (J1B.g7), FMC_HPC2 (IC2.AF28)
LA2.LA00_CC_P: HPC2 (J1B.g6), FMC_HPC2 (IC2.AE28)
LA2.LA01_CC_N: HPC2 (J1B.d9), FMC_HPC2 (IC2.AF29)
LA2.LA01_CC_P: HPC2 (J1B.d8), FMC_HPC2 (IC2.AF30)
LA2.LA02_N: HPC2 (J1B.h8), FMC_HPC2 (IC2.AG31)
LA2.LA02_P: HPC2 (J1B.h7), FMC_HPC2 (IC2.AH31)
LA2.LA03_N: HPC2 (J1B.g10), FMC_HPC2 (IC2.AG24)
LA2.LA03_P: HPC2 (J1B.g9), FMC_HPC2 (IC2.AH24)
LA2.LA04_N: HPC2 (J1B.h11), FMC_HPC2 (IC2.AC26)
LA2.LA04_P: HPC2 (J1B.h10), FMC_HPC2 (IC2.AC27)
LA2.LA05_N: HPC2 (J1B.d12), FMC_HPC2 (IC2.AH33)
LA2.LA05_P: HPC2 (J1B.d11), FMC_HPC2 (IC2.AH34)
LA2.LA06_N: HPC2 (J1B.c11), FMC_HPC2 (IC2.AF23)
LA2.LA06_P: HPC2 (J1B.c10), FMC_HPC2 (IC2.AE23)
LA2.LA07_N: HPC2 (J1B.h14), FMC_HPC2 (IC2.AG27)
LA2.LA07_P: HPC2 (J1B.h13), FMC_HPC2 (IC2.AH27)
LA2.LA08_N: HPC2 (J1B.g13), FMC_HPC2 (IC2.AE25)
LA2.LA08_P: HPC2 (J1B.g12), FMC_HPC2 (IC2.AD25)
LA2.LA09_N: HPC2 (J1B.d15), FMC_HPC2 (IC2.AF25)
LA2.LA09_P: HPC2 (J1B.d14), FMC_HPC2 (IC2.AG25)
LA2.LA10_N: HPC2 (J1B.c15), FMC_HPC2 (IC2.AG32)
LA2.LA10_P: HPC2 (J1B.c14), FMC_HPC2 (IC2.AH32)
LA2.LA11_N: HPC2 (J1B.h17), FMC_HPC2 (IC2.AD30)
LA2.LA11_P: HPC2 (J1B.h16), FMC_HPC2 (IC2.AE30)
LA2.LA12_N: HPC2 (J1B.g16), FMC_HPC2 (IC2.AE27)
LA2.LA12_P: HPC2 (J1B.g15), FMC_HPC2 (IC2.AF27)
LA2.LA13_N: HPC2 (J1B.d18), FMC_HPC2 (IC2.AF34)
LA2.LA13_P: HPC2 (J1B.d17), FMC_HPC2 (IC2.AG34)
LA2.LA14_N: HPC2 (J1B.c19), FMC_HPC2 (IC2.AE33)
LA2.LA14_P: HPC2 (J1B.c18), FMC_HPC2 (IC2.AF33)
LA2.LA15_N: HPC2 (J1B.h20), FMC_HPC2 (IC2.AD28)
LA2.LA15_P: HPC2 (J1B.h19), FMC_HPC2 (IC2.AD29)
LA2.LA16_N: HPC2 (J1B.g19), FMC_HPC2 (IC2.AD34)
LA2.LA16_P: HPC2 (J1B.g18), FMC_HPC2 (IC2.AD33)
LA2.LA17_CC_N: HPC2 (J1B.d21), FMC_HPC2 (IC2.AB31)
LA2.LA17_CC_P: HPC2 (J1B.d20), FMC_HPC2 (IC2.AB32)
LA2.LA18_CC_N: HPC2 (J1B.c23), FMC_HPC2 (IC2.W31)
LA2.LA18_CC_P: HPC2 (J1B.c22), FMC_HPC2 (IC2.W30)
LA2.LA19_N: HPC2 (J1B.h23), FMC_HPC2 (IC2.AB26)
LA2.LA19_P: HPC2 (J1B.h22), FMC_HPC2 (IC2.AB27)
LA2.LA20_N: HPC2 (J1B.g22), FMC_HPC2 (IC2.AB25)
LA2.LA20_P: HPC2 (J1B.g21), FMC_HPC2 (IC2.AB24)
LA2.LA21_N: HPC2 (J1B.h26), FMC_HPC2 (IC2.AA32)
LA2.LA21_P: HPC2 (J1B.h25), FMC_HPC2 (IC2.AA33)
LA2.LA22_N: HPC2 (J1B.g25), FMC_HPC2 (IC2.AA24)
LA2.LA22_P: HPC2 (J1B.g24), FMC_HPC2 (IC2.AA25)
LA2.LA23_N: HPC2 (J1B.d24), FMC_HPC2 (IC2.W25)
LA2.LA23_P: HPC2 (J1B.d23), FMC_HPC2 (IC2.Y25)
LA2.LA24_N: HPC2 (J1B.h29), FMC_HPC2 (IC2.Y33)
LA2.LA24_P: HPC2 (J1B.h28), FMC_HPC2 (IC2.Y32)
LA2.LA25_N: HPC2 (J1B.g28), FMC_HPC2 (IC2.AA29)
LA2.LA25_P: HPC2 (J1B.g27), FMC_HPC2 (IC2.AB29)
LA2.LA26_N: HPC2 (J1B.d27), FMC_HPC2 (IC2.AC31)
LA2.LA26_P: HPC2 (J1B.d26), FMC_HPC2 (IC2.AC32)
LA2.LA27_N: HPC2 (J1B.c27), FMC_HPC2 (IC2.AA28)
LA2.LA27_P: HPC2 (J1B.c26), FMC_HPC2 (IC2.AA27)
LA2.LA28_N: HPC2 (J1B.h32), FMC_HPC2 (IC2.W28)
LA2.LA28_P: HPC2 (J1B.h31), FMC_HPC2 (IC2.W29)
LA2.LA29_N: HPC2 (J1B.g31), FMC_HPC2 (IC2.AC33)
LA2.LA29_P: HPC2 (J1B.g30), FMC_HPC2 (IC2.AC34)
LA2.LA30_N: HPC2 (J1B.h35), FMC_HPC2 (IC2.W34)
LA2.LA30_P: HPC2 (J1B.h34), FMC_HPC2 (IC2.W33)
LA2.LA31_N: HPC2 (J1B.g34), FMC_HPC2 (IC2.V31)
LA2.LA31_P: HPC2 (J1B.g33), FMC_HPC2 (IC2.V32)
LA2.LA32_N: HPC2 (J1B.h38), FMC_HPC2 (IC2.AB34)
LA2.LA32_P: HPC2 (J1B.h37), FMC_HPC2 (IC2.AA34)
LA2.LA33_N: HPC2 (J1B.g37), FMC_HPC2 (IC2.V34)
LA2.LA33_P: HPC2 (J1B.g36), FMC_HPC2 (IC2.V33)
MGT.FP2_CLK1_N: FPGA_MGT (C459.1), Clock_management (IC8.49)
MGT.FP2_CLK1_P: FPGA_MGT (C457.1), Clock_management (IC8.48)
MGT.FP2_CLK2_N: FPGA_MGT (C463.1), Clock_management (IC8.43)
MGT.FP2_CLK2_P: FPGA_MGT (C461.1), Clock_management (IC8.42)
MGT.LINK01_CLK_N: FPGA_MGT (C220.1), Clock_management (IC8.46)
MGT.LINK01_CLK_P: FPGA_MGT (C219.1), Clock_management (IC8.45)
MGT.PCIE_CLK1_N: FPGA_MGT (C409.1), Clock_management (IC8.78)
MGT.PCIE_CLK1_P: FPGA_MGT (C402.1), Clock_management (IC8.77)
MGT.PCIE_CLK2_N: FPGA_MGT (C413.1), Clock_management (IC8.81)
MGT.PCIE_CLK2_P: FPGA_MGT (C411.1), Clock_management (IC8.80)
MISC1.PG_C2M: HPC1 (J1A.d1), CPU (R17.1 R98.1 U1.56)
MISC1.PG_M2C: HPC1 (J1A.f1), CPU (R15.1 R100.1 U1.58)
MISC1.PRSNT: HPC1 (J1A.h2), CPU (R13.1 R102.1 U1.60)
MISC2.PG_C2M: HPC2 (J1B.d1), CPU (R18.1 R97.1 U1.55)
MISC2.PG_M2C: HPC2 (J1B.f1), CPU (R16.1 R99.1 U1.57)
MISC2.PRSNT: HPC2 (J1B.h2), CPU (R14.1 R101.1 U1.59)
MLVDS_F.IO_RX_P17: FPGA_SDRAM (IC2.AM9), M-LVDS PHY (IC28.3)
MLVDS_F.IO_RX_P18: FPGA_SDRAM (IC2.AP10), M-LVDS PHY (IC34.3)
MLVDS_F.IO_RX_P19: FPGA_SDRAM (IC2.AN8), M-LVDS PHY (IC36.3)
MLVDS_F.IO_RX_P20: FPGA_SDRAM (IC2.AL8), M-LVDS PHY (IC38.3)
MLVDS_F.IO_TX_P17: FPGA_SDRAM (IC2.AP11), M-LVDS PHY (IC29.3)
MLVDS_F.IO_TX_P18: FPGA_SDRAM (IC2.AM11), M-LVDS PHY (IC35.3)
MLVDS_F.IO_TX_P19: FPGA_SDRAM (IC2.AP8), M-LVDS PHY (IC37.3)
MLVDS_F.IO_TX_P20: FPGA_SDRAM (IC2.AL9), M-LVDS PHY (IC39.3)
MLVDS_F.~{RE}_DE_RX_P17: FPGA_SDRAM (IC2.AJ10), M-LVDS PHY (IC28.5 IC40.10)
MLVDS_F.~{RE}_DE_RX_P18: FPGA_SDRAM (IC2.AJ11), M-LVDS PHY (IC34.5 IC40.8)
MLVDS_F.~{RE}_DE_RX_P19: FPGA_SDRAM (IC2.AM10), M-LVDS PHY (IC36.5 IC40.6)
MLVDS_F.~{RE}_DE_RX_P20: FPGA_SDRAM (IC2.AN9), M-LVDS PHY (IC38.5 IC40.4)
MLVDS_F.~{RE}_DE_TX_P17: FPGA_SDRAM (IC2.AK11), M-LVDS PHY (IC29.5 IC40.9)
MLVDS_F.~{RE}_DE_TX_P18: FPGA_SDRAM (IC2.AL10), M-LVDS PHY (IC35.5 IC40.7)
MLVDS_F.~{RE}_DE_TX_P19: FPGA_SDRAM (IC2.AN11), M-LVDS PHY (IC37.5 IC40.5)
MLVDS_F.~{RE}_DE_TX_P20: FPGA_SDRAM (IC2.AP9), M-LVDS PHY (IC39.5 IC40.3)
MOD_HANDLE: IPMI (PB1.1 PB1.2), CPU (IC1.50 R19.1 U1.87)
PLL_CTRL.PLL_VADJ2_DAC1_SYNC_N: FMC_HPC2 (IC2.R25), Clock_management (IC41.5)
PLL_CTRL.PLL_VADJ2_DAC2_SYNC_N: FMC_HPC2 (IC2.AL24), Clock_management (IC41.3)
PLL_CTRL.PLL_VADJ2_DAC_DIN: FMC_HPC2 (IC2.AF24), Clock_management (IC41.6)
PLL_CTRL.PLL_VADJ2_DAC_SCLK: FMC_HPC2 (IC2.AJ24), Clock_management (IC41.4)
PLL_CTRL.VADJ2_CLK_UPDATEn: FMC_HPC2 (IC2.U24), Clock_management (IC41.9)
PLL_CTRL.VADJ2_SI57X_OE: FMC_HPC2 (IC2.AD23), Clock_management (IC41.7)
PLL_CTRL.VADJ2_SI57X_SCL: FMC_HPC2 (IC2.V24), Clock_management (IC42.2 R271.2)
PLL_CTRL.VADJ2_SI57X_SDA: FMC_HPC2 (IC2.W24), Clock_management (IC42.3 R214.2)
PLL_CTRL.VADJ2_SI57X_TUNE: FMC_HPC2 (IC2.T24), Clock_management (IC41.8)
PLL_DAC1_SYNC_N: Clock_management (IC41.21), Clock_WR (IC53.5)
PLL_DAC2_SYNC_N: Clock_management (IC41.19), Clock_WR (IC52.5)
PLL_DAC_DIN: Clock_management (IC41.18), Clock_WR (IC52.7 IC53.7)
PLL_DAC_SCLK: Clock_management (IC41.20), Clock_WR (IC52.6 IC53.6)
POWER2.3P3VAUX: AMC_FMC_Carrier (R124.1), HPC2 (C16B.1 C17B.1 J1B.d32)
RESETn: FMC_HPC2 (D3.K), CPU (IC1.36 U1.8), Clock_management (IC8.1)
Rx2C_N: FPGA_MGT (C512.2), AMC-SATA (C760.1)
Rx2C_P: FPGA_MGT (C455.2), AMC-SATA (C761.1)
Rx3C_N: FPGA_MGT (C751.2), AMC-SATA (C756.1)
Rx3C_P: FPGA_MGT (C590.2), AMC-SATA (C757.1)
SCN.ADR0: CPU (IC1.75 U1.95), JTAG_Configuration (IC6.12)
SCN.ADR1: CPU (IC1.74 U1.96), JTAG_Configuration (IC6.13)
SCN.ADR2: CPU (IC1.73 U1.97), JTAG_Configuration (IC6.14)
SCN.ADR3: CPU (IC1.70 U1.98), JTAG_Configuration (IC6.15)
SCN.ADR4: CPU (IC1.69 U1.99), JTAG_Configuration (IC6.16)
SCN.ADR5: CPU (IC1.68 U1.100), JTAG_Configuration (IC6.17)
SCN.ADR6: CPU (IC1.67 U1.1), JTAG_Configuration (IC6.18)
SCN.RSTn: CPU (IC1.66 U1.2), JTAG_Configuration (IC6.7)
SI57X_CLK_N: Clock_management (C403.1), Clock_WR (OSC4.5)
SI57X_CLK_P: Clock_management (C401.1), Clock_WR (OSC4.4)
SI57X_OE: Clock_management (IC41.17), Clock_WR (OSC4.2 R223.1)
SI57X_SCL: Clock_management (IC42.7 R68.2), Clock_WR (OSC4.8 R220.1)
SI57X_SDA: Clock_management (IC42.6 R67.2), Clock_WR (OSC4.7 R272.1)
SI57X_TUNE: Clock_management (IC41.16), Clock_WR (R224.2)
SW: IPMI (S1.1), CPU (IC1.51 R238.1 U1.37)
Tx2C_N: FPGA_MGT (C514.2), AMC-SATA (C759.1)
Tx2C_P: FPGA_MGT (C575.2), AMC-SATA (C758.1)
Tx3C_N: FPGA_MGT (C752.2), AMC-SATA (C755.1)
Tx3C_P: FPGA_MGT (C753.2), AMC-SATA (C754.1)
UPDATEn: CPU (IC1.40 U1.22), Clock_management (R139.2)
VREF1.VREF_A_M2C: HPC1 (J1A.h1), FMC_HPC1 (8 pins)
VREF1.VREF_B_M2C: HPC1 (J1A.k1), FMC_HPC1 (C114.1 C121.1 IC2.AA7 IC2.Y6)
VREF2.VREF_A_M2C: HPC2 (J1B.h1), FMC_HPC2 (8 pins)
VREF2.VREF_B_M2C: HPC2 (J1B.k1), FMC_HPC2 (C129.1 C392.1 IC2.P25 IC2.R32)
WR_PLL_CLK1_N: Clock_management (C399.1), Clock_WR (IC50.5)
WR_PLL_CLK1_P: Clock_management (C397.1), Clock_WR (IC50.6)